# EAGLE schematic ChargingCircuit (EAGLE 7.6.0)
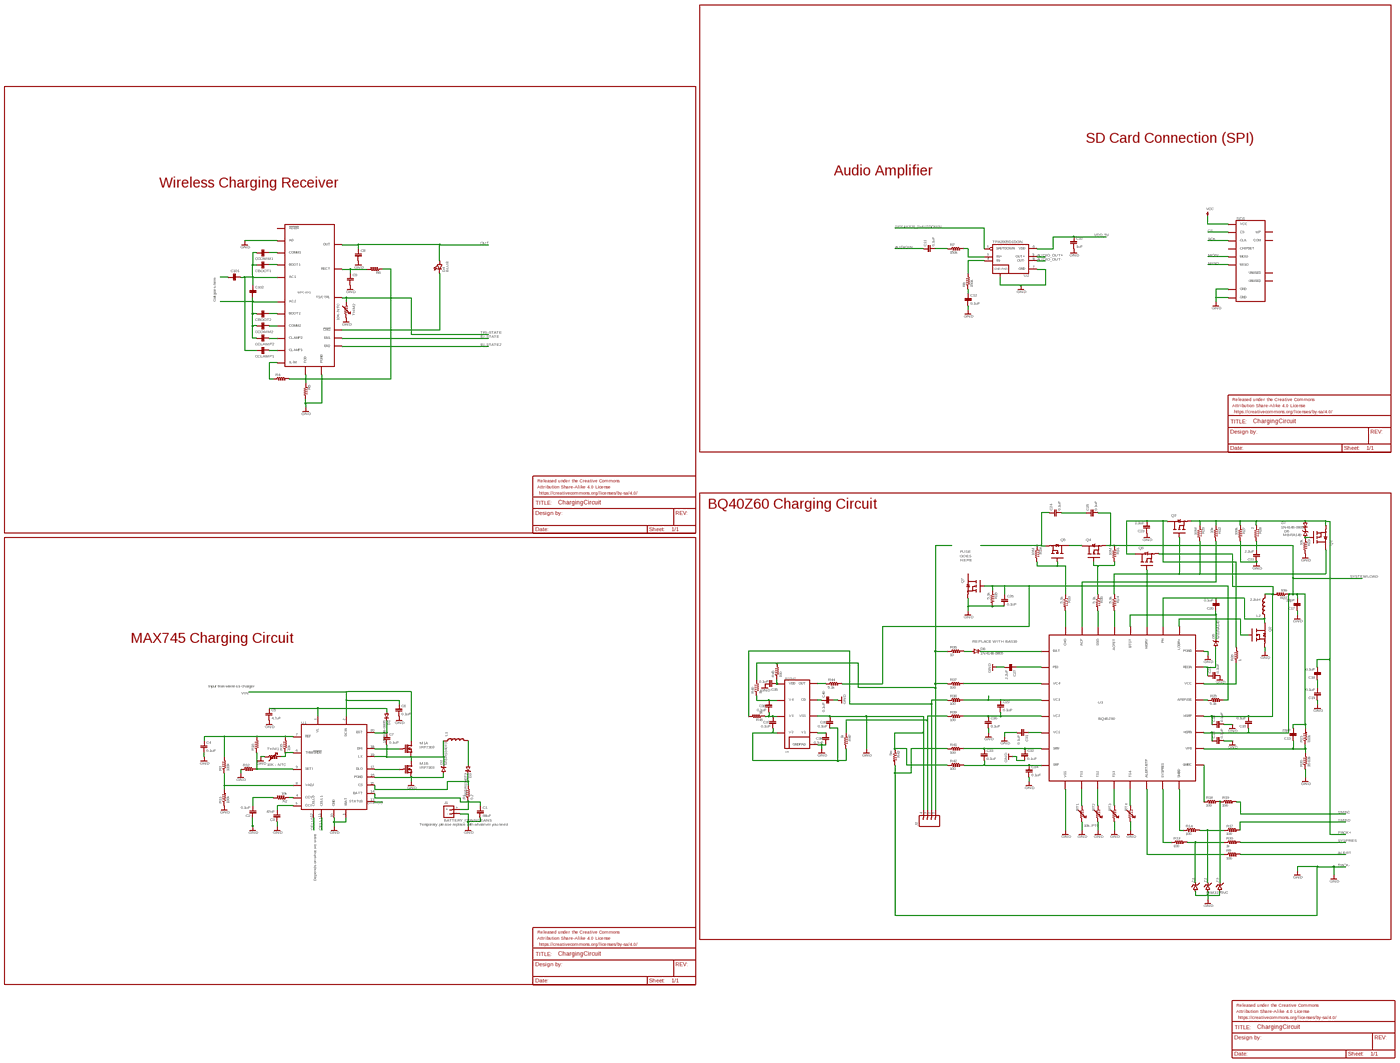
[diagram p0: schematic, sheet 1, overview]
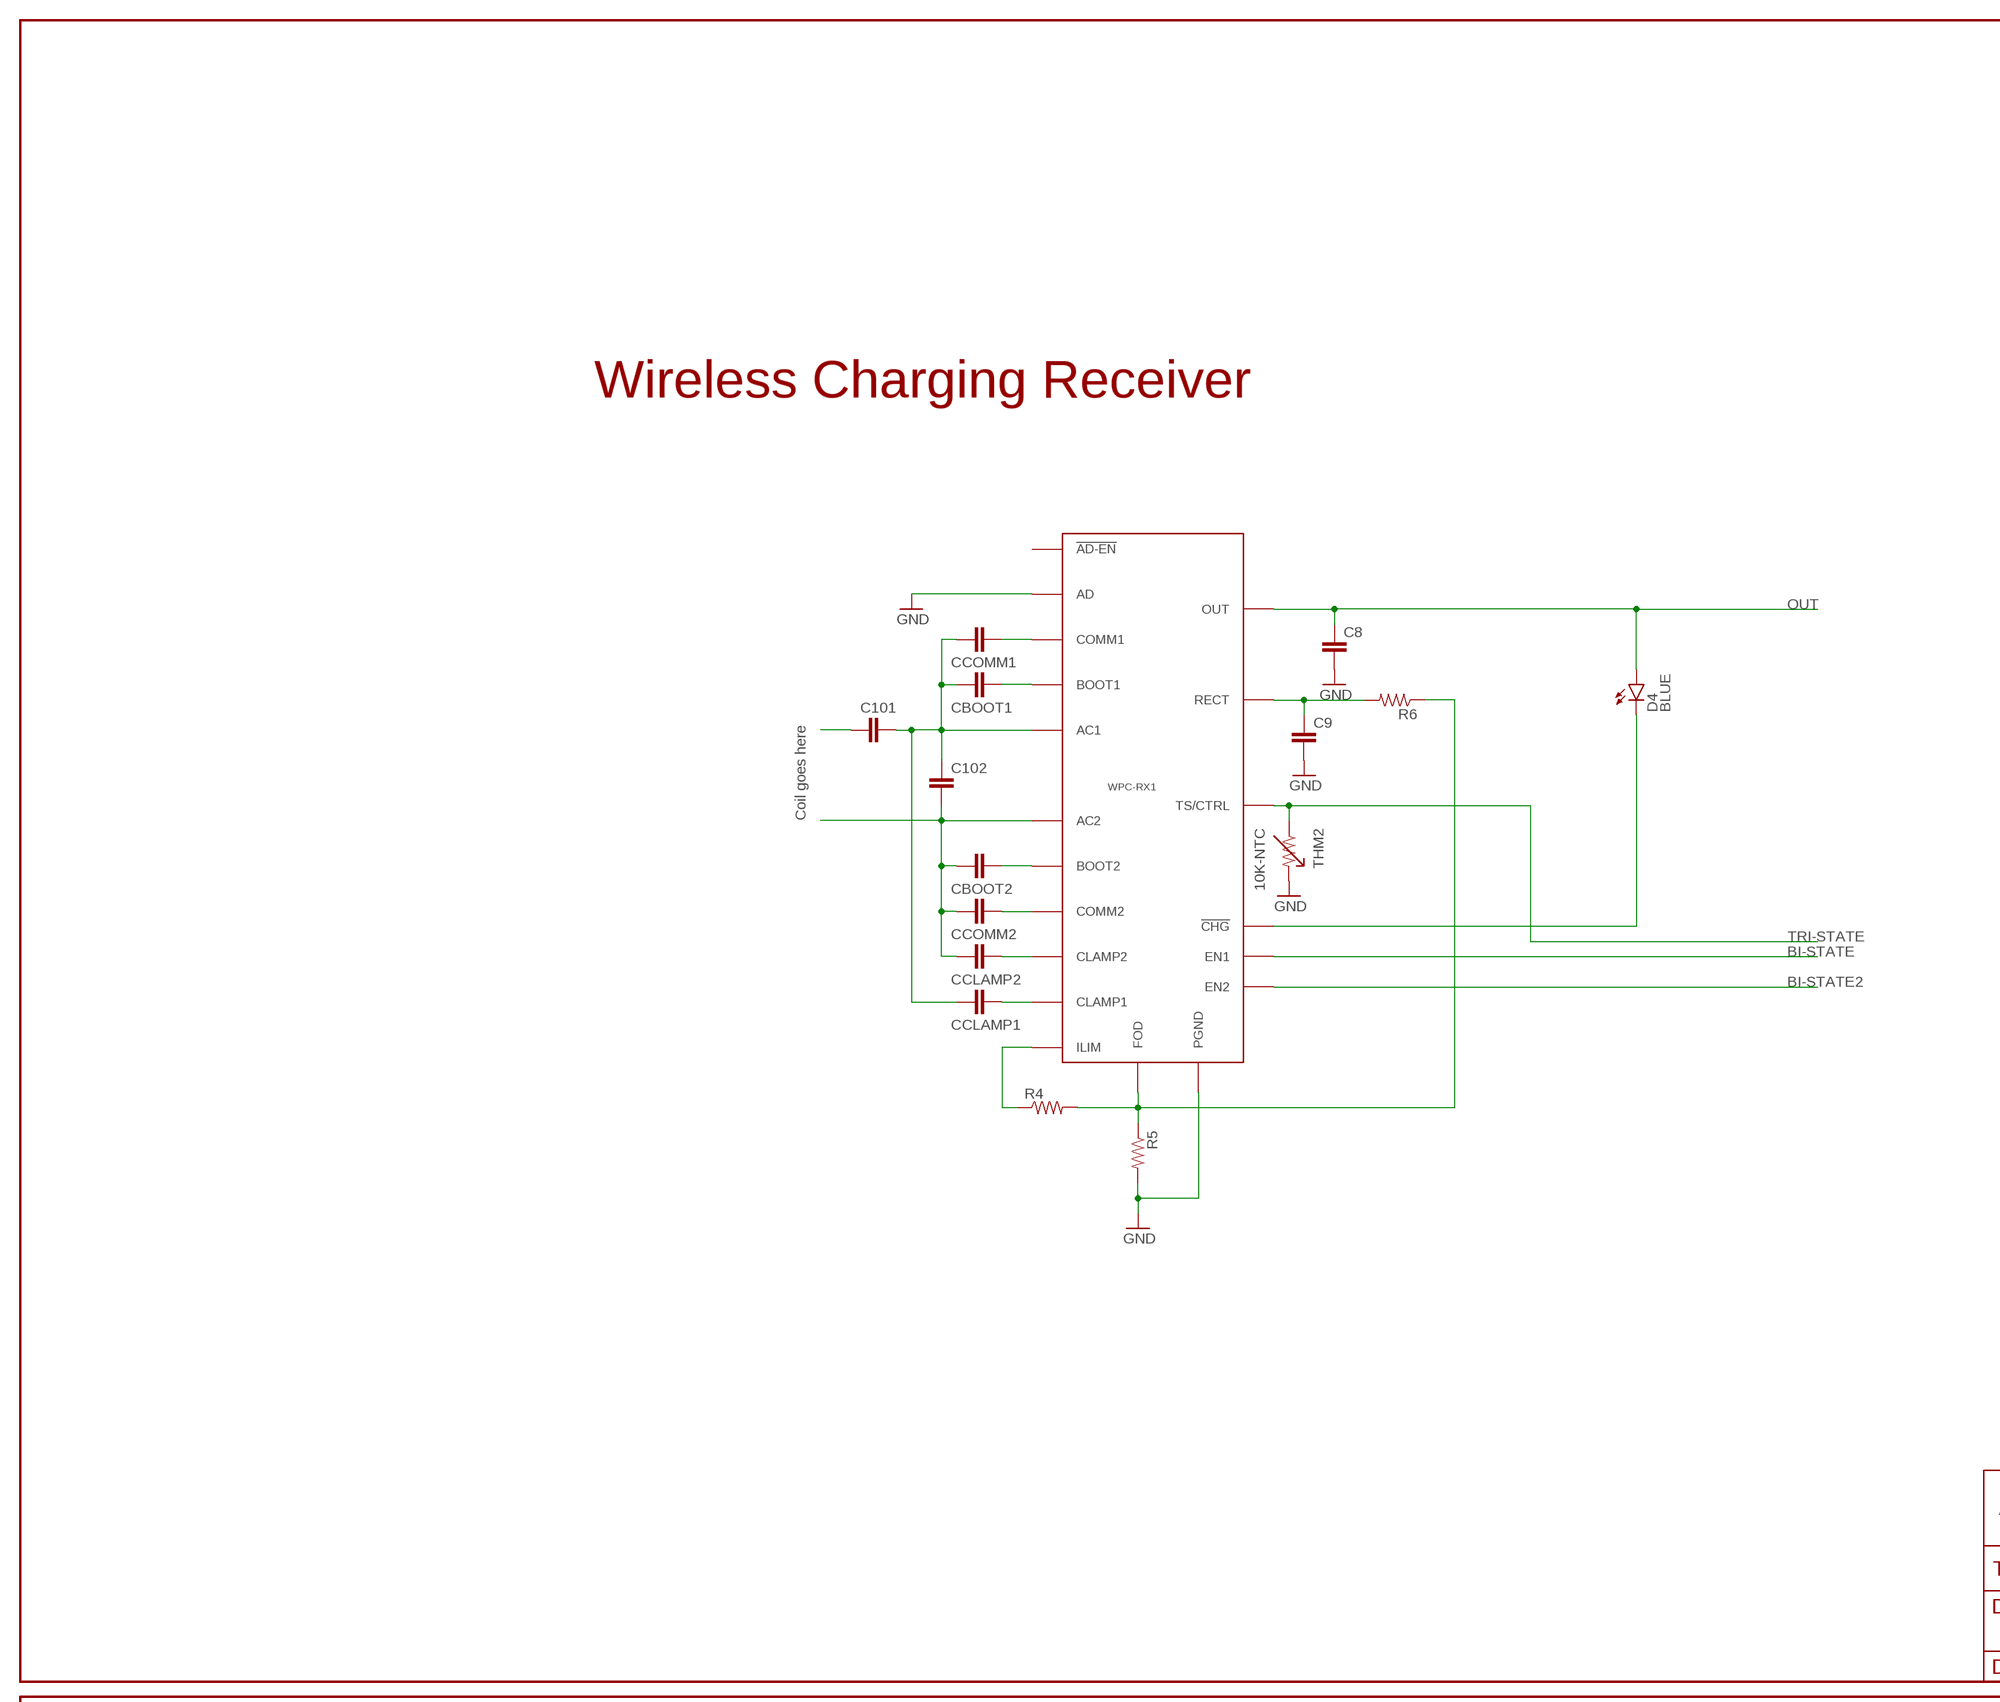
[diagram p1: schematic, sheet 1, part 1 of 4]
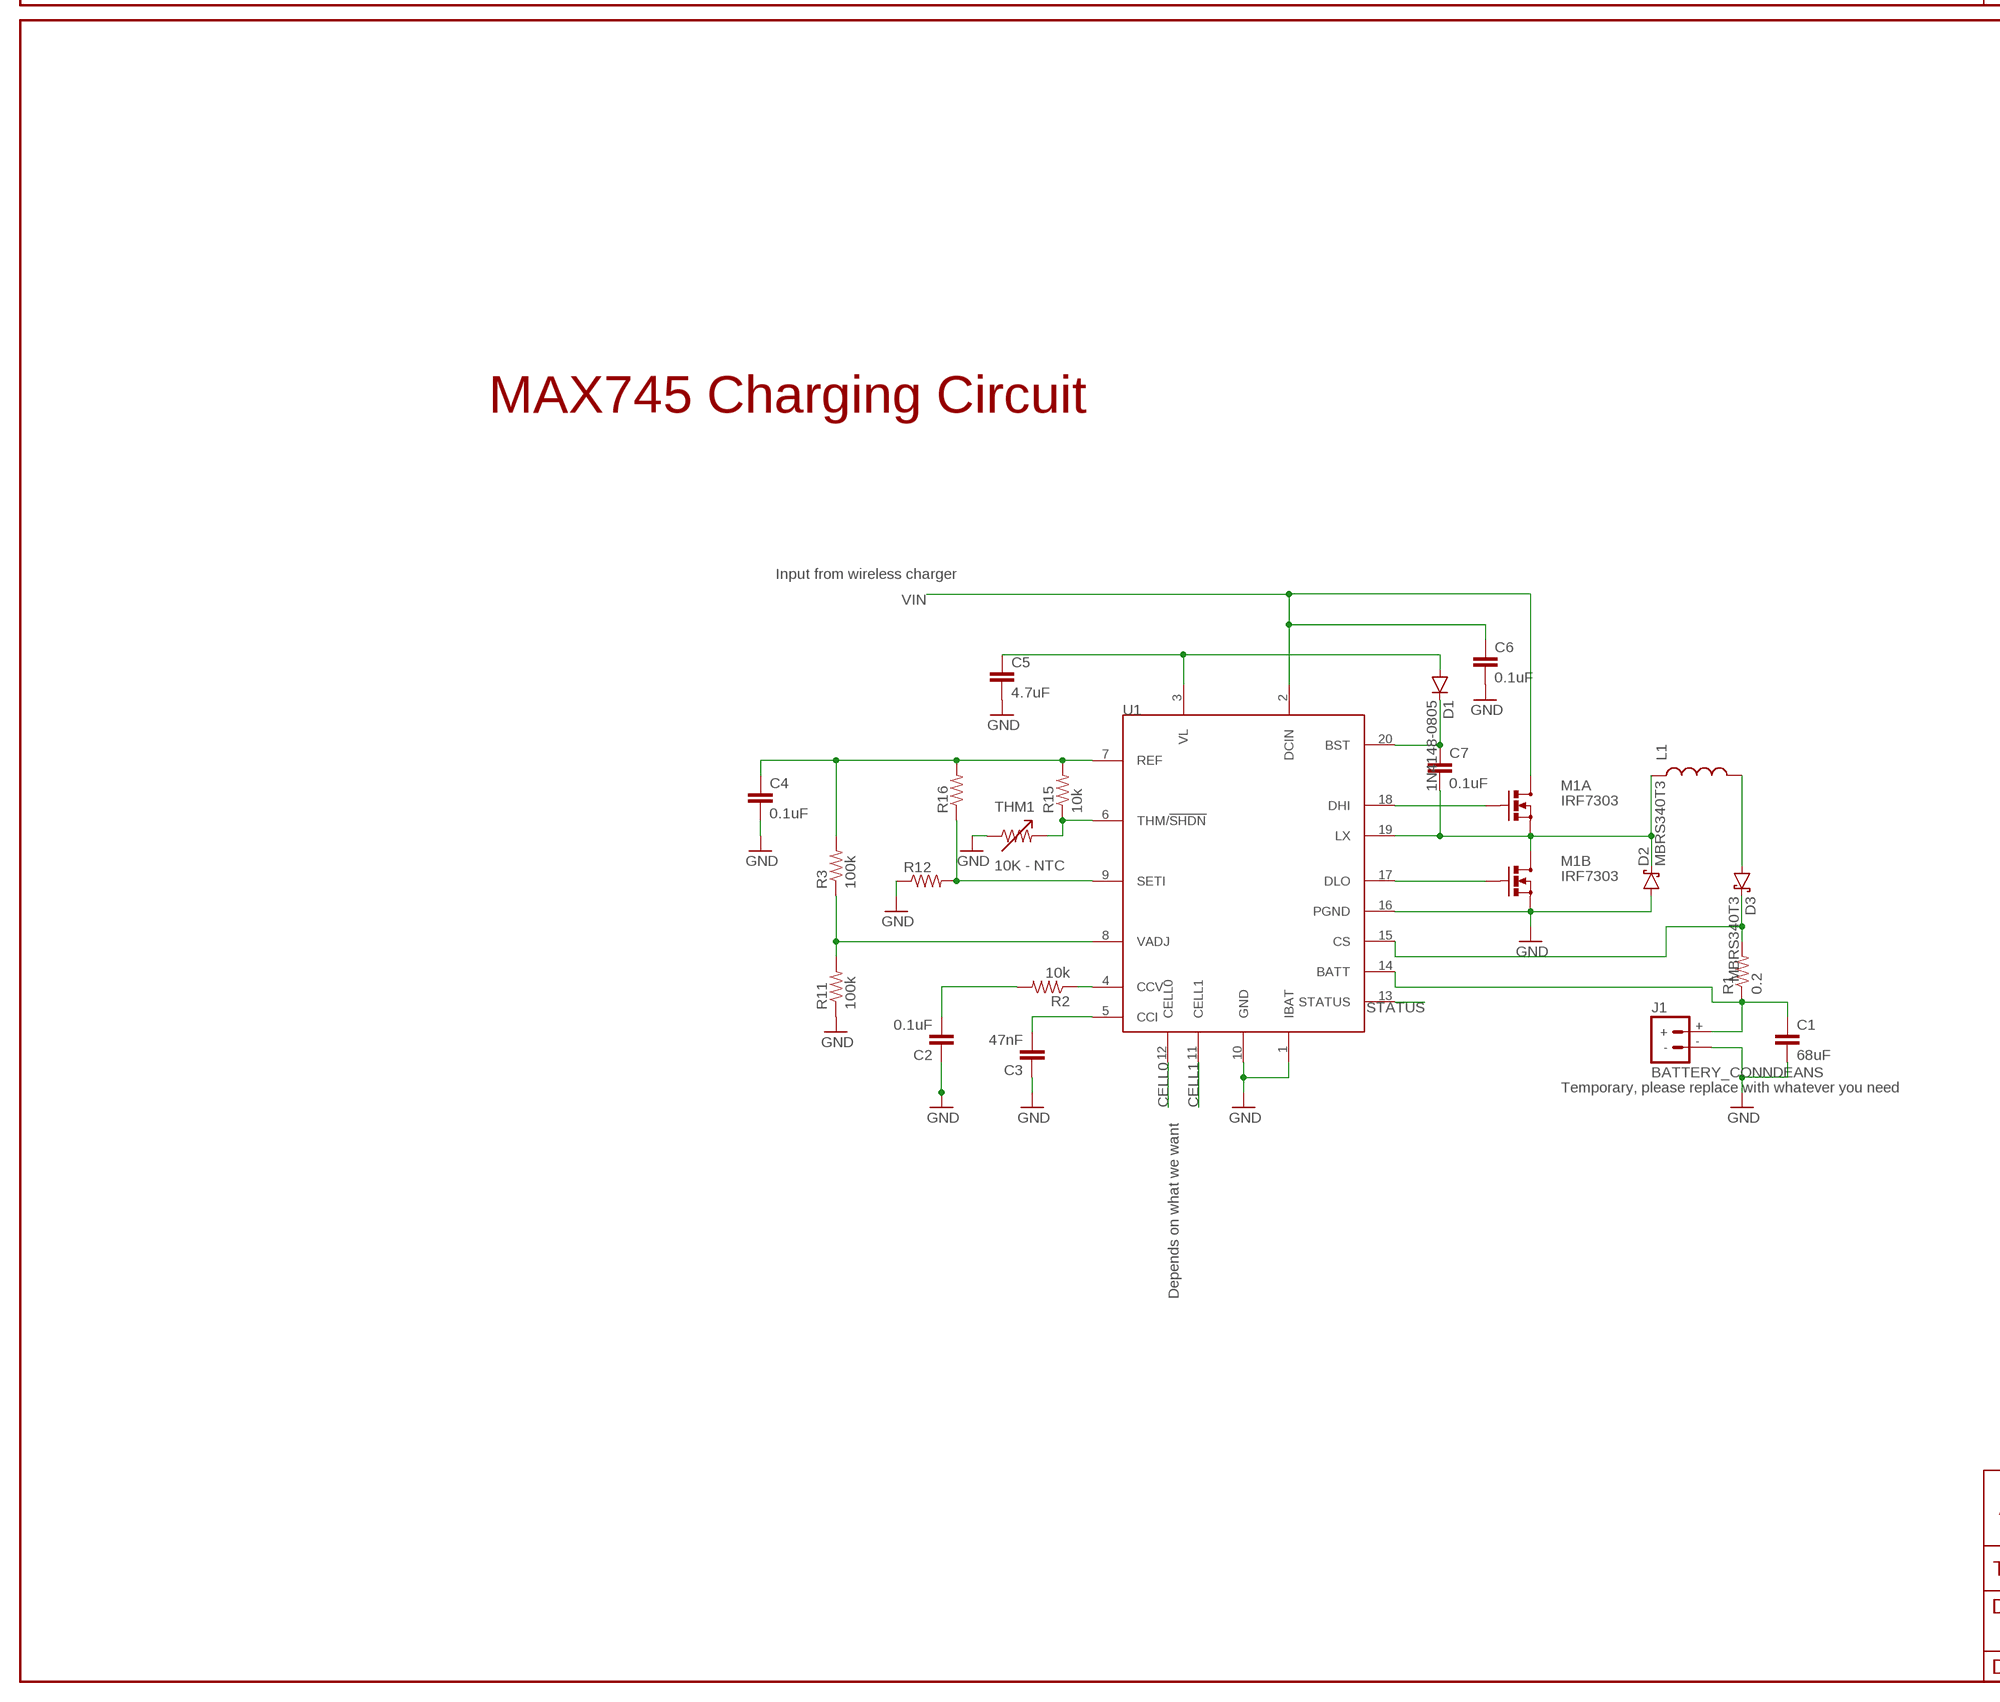
[diagram p2: schematic, sheet 1, part 2 of 4]
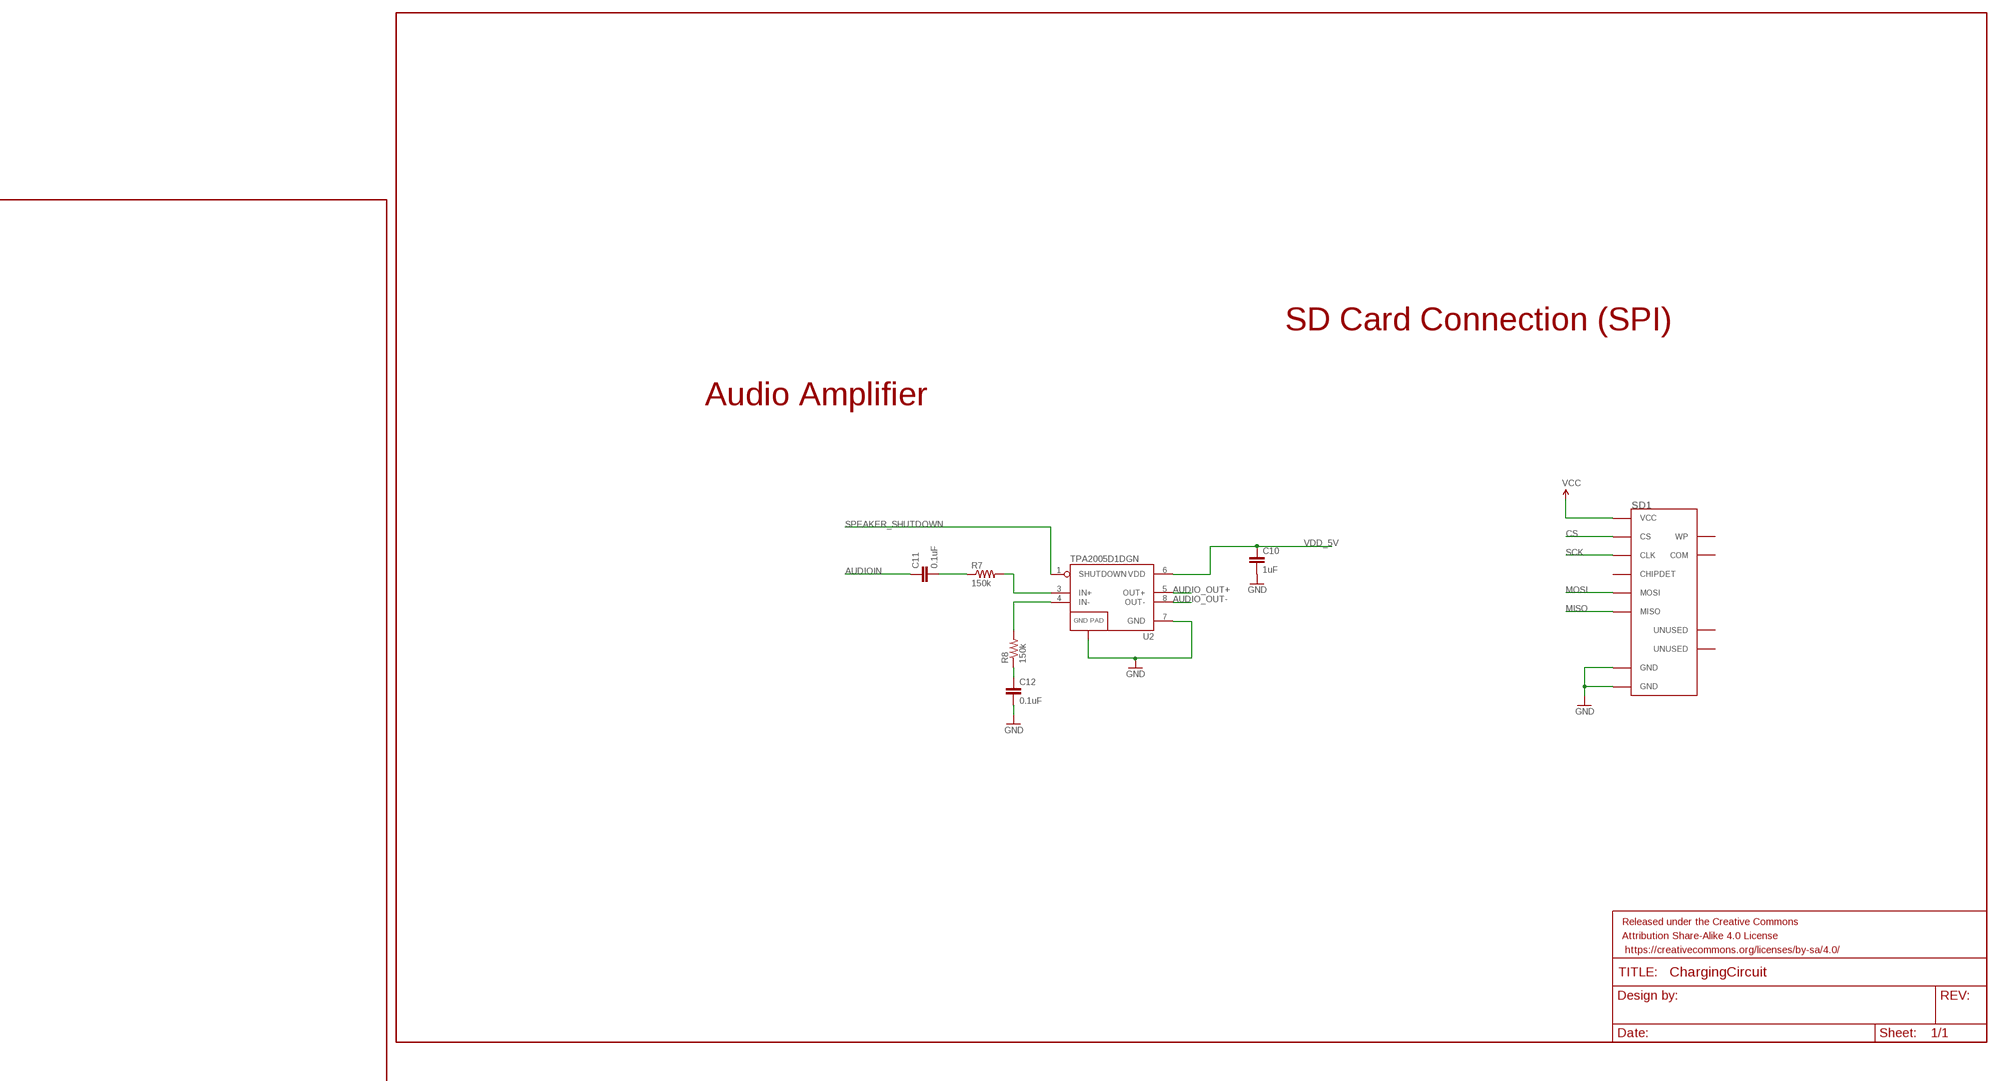
[diagram p3: schematic, sheet 1, part 3 of 4]
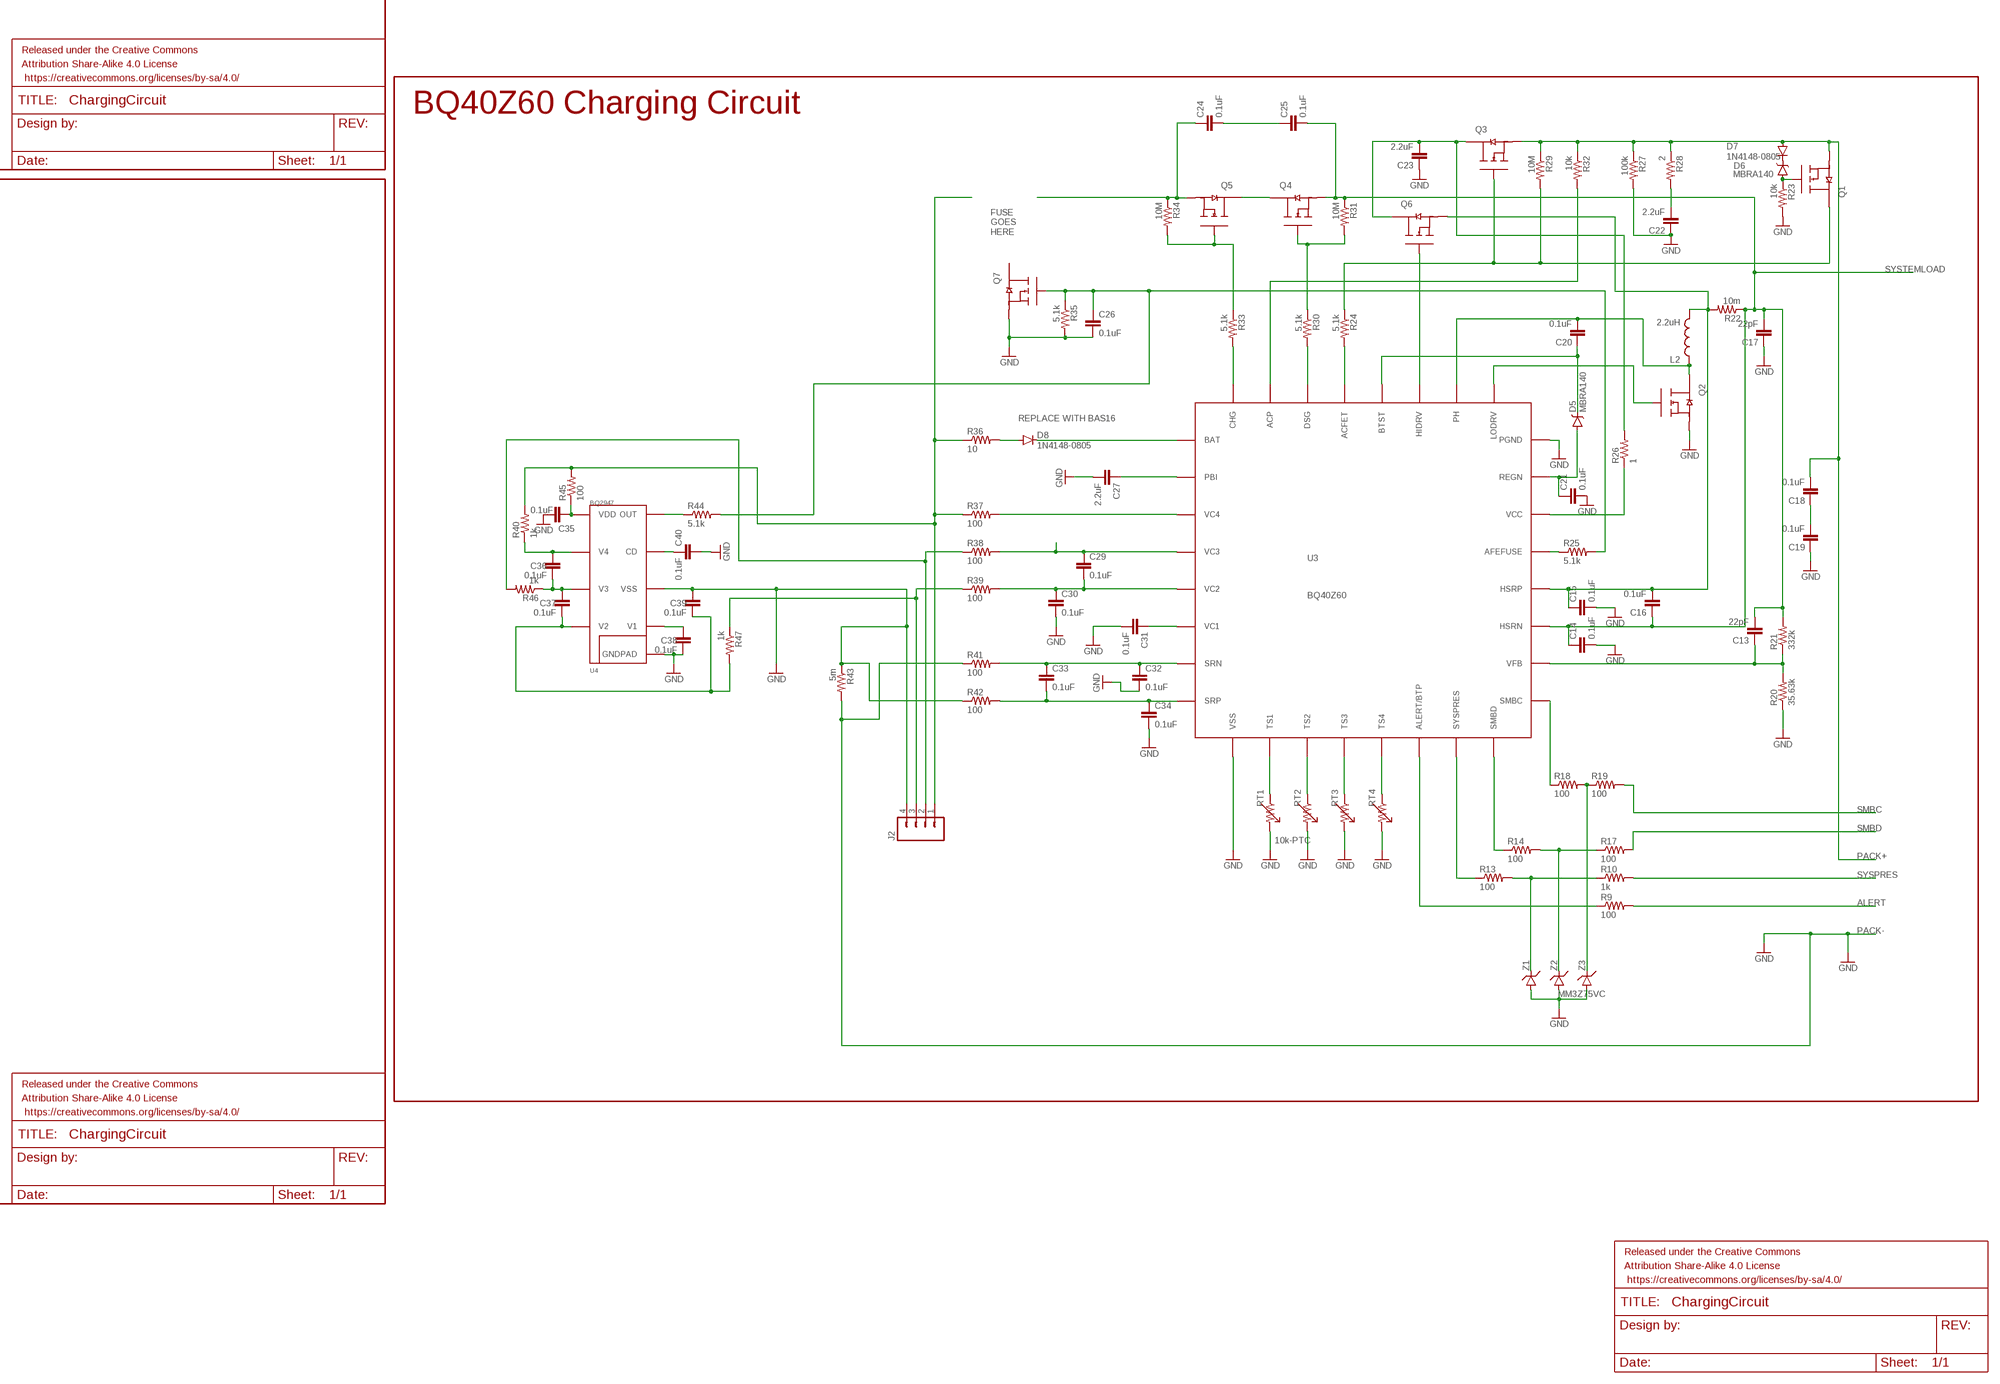
[diagram p4: schematic, sheet 1, part 4 of 4]

## Parts
C1  68uF  CAP0805  [0805]
C2  0.1uF  CAP0805  [0805]
C3  47nF  CAP0805  [0805]
C4  0.1uF  CAP0805  [0805]
C5  4.7uF  CAP0805  [0805]
C6  0.1uF  CAP0805  [0805]
C7  0.1uF  CAP0805  [0805]
C8  CAP0805  [0805]
C9  CAP0805  [0805]
C10  1uF  CAP0805  [0805]
C11  0.1uF  CAP0805  [0805]
C12  0.1uF  CAP0805  [0805]
C13  22pF  CAP0805  [0805]
C14  0.1uF  CAP0805  [0805]
C15  0.1uF  CAP0805  [0805]
C16  0.1uF  CAP0805  [0805]
C17  22pF  CAP0805  [0805]
C18  0.1uF  CAP0805  [0805]
C19  0.1uF  CAP0805  [0805]
C20  0.1uF  CAP0805  [0805]
C21  0.1uF  CAP0805  [0805]
C22  2.2uF  CAP0805  [0805]
C23  2.2uF  CAP0805  [0805]
C24  0.1uF  CAP0805  [0805]
C25  0.1uF  CAP0805  [0805]
C26  0.1uF  CAP0805  [0805]
C27  2.2uF  CAP0805  [0805]
C29  0.1uF  CAP0805  [0805]
C30  0.1uF  CAP0805  [0805]
C31  0.1uF  CAP0805  [0805]
C32  0.1uF  CAP0805  [0805]
C33  0.1uF  CAP0805  [0805]
C34  0.1uF  CAP0805  [0805]
C35  0.1uF  CAP0805  [0805]
C36  0.1uF  CAP0805  [0805]
C37  0.1uF  CAP0805  [0805]
C38  0.1uF  CAP0805  [0805]
C39  0.1uF  CAP0805  [0805]
C40  0.1uF  CAP0805  [0805]
C101  CAP0805  [0805]
C102  CAP0805  [0805]
CBOOT1  CAP0805  [0805]
CBOOT2  CAP0805  [0805]
CCLAMP1  CAP0805  [0805]
CCLAMP2  CAP0805  [0805]
CCOMM1  CAP0805  [0805]
CCOMM2  CAP0805  [0805]
D1  1N4148-0805  [0805-DIODE]
D2  MBRS340T3  [DO-214AB]
D3  MBRS340T3  [DO-214AB]
D4  BLUE  LED-BLUE0603  [LED-0603]
D5  MBRA140  [SMA-DIODE]
D6  MBRA140  DIODE-SCHOTTKY-MBRA140  [SMA-DIODE]
D7  1N4148-0805  [0805-DIODE]
D8  1N4148-0805  [0805-DIODE]
FRAME6  FRAME-LEDGER  [CREATIVE_COMMONS]
FRAME7  FRAME-LEDGER  [CREATIVE_COMMONS]
FRAME8  FRAME-LEDGER  [CREATIVE_COMMONS]
FRAME9  FRAME-LEDGER  [CREATIVE_COMMONS]
J1  BATTERY_CONNDEANS  [DEANS]
J2  M04JST  [1X04-1.5MM_JST]
L1  INDUCTOR0805  [0805]
L2  2.2uH  INDUCTOR0805  [0805]
M1  IRF7303  [SO08]
Q1  CSD17308Q3  [SON-8]
Q2  CSD17308Q3  [SON-8]
Q3  CSD17308Q3  [SON-8]
Q4  CSD17308Q3  [SON-8]
Q5  CSD17308Q3  [SON-8]
Q6  CSD17308Q3  [SON-8]
Q7  CSD17308Q3  [SON-8]
R1  0.2  RESISTOR0805-RES  [0805]
R2  10k  RESISTOR0805-RES  [0805]
R3  100k  RESISTOR0805-RES  [0805]
R4  RESISTOR0805-RES  [0805]
R5  RESISTOR0805-RES  [0805]
R6  RESISTOR0805-RES  [0805]
R7  150k  RESISTOR0805-RES  [0805]
R8  150k  RESISTOR0805-RES  [0805]
R9  100  RESISTOR0805-RES  [0805]
R10  1k  RESISTOR0805-RES  [0805]
R11  100k  RESISTOR0805-RES  [0805]
R12  RESISTOR0805-RES  [0805]
R13  100  RESISTOR0805-RES  [0805]
R14  100  RESISTOR0805-RES  [0805]
R15  10k  RESISTOR0805-RES  [0805]
R16  RESISTOR0805-RES  [0805]
R17  100  RESISTOR0805-RES  [0805]
R18  100  RESISTOR0805-RES  [0805]
R19  100  RESISTOR0805-RES  [0805]
R20  35.63k  RESISTOR0805-RES  [0805]
R21  332k  RESISTOR0805-RES  [0805]
R22  10m  RESISTOR0805-RES  [0805]
R23  10k  RESISTOR0805-RES  [0805]
R24  5.1k  RESISTOR0805-RES  [0805]
R25  5.1k  RESISTOR0805-RES  [0805]
R26  1  RESISTOR0805-RES  [0805]
R27  100k  RESISTOR0805-RES  [0805]
R28  2  RESISTOR0805-RES  [0805]
R29  10M  RESISTOR0805-RES  [0805]
R30  5.1k  RESISTOR0805-RES  [0805]
R31  10M  RESISTOR0805-RES  [0805]
R32  10k  RESISTOR0805-RES  [0805]
R33  5.1k  RESISTOR0805-RES  [0805]
R34  10M  RESISTOR0805-RES  [0805]
R35  5.1k  RESISTOR0805-RES  [0805]
R36  10  RESISTOR0805-RES  [0805]
R37  100  RESISTOR0805-RES  [0805]
R38  100  RESISTOR0805-RES  [0805]
R39  100  RESISTOR0805-RES  [0805]
R40  1k  RESISTOR0805-RES  [0805]
R41  100  RESISTOR0805-RES  [0805]
R42  100  RESISTOR0805-RES  [0805]
R43  5m  RESISTOR0805-RES  [0805]
R44  5.1k  RESISTOR0805-RES  [0805]
R45  100  RESISTOR0805-RES  [0805]
R46  1k  RESISTOR0805-RES  [0805]
R47  1k  RESISTOR0805-RES  [0805]
RT1  10k-PTC  THM  [0805]
RT2  THM  [0805]
RT3  THM  [0805]
RT4  THM  [0805]
SD1  5738-SDCARD  [SD-5738]
THM1  10K - NTC  THM  [0805]
THM2  10K-NTC  THM  [0805]
U1  MAX745EACSSOP  [SSOP20]
U2  TPA2005D1DGN  [POWER-SOP8]
U3  BQ40Z60  [S-PVQFN-N32]
U4  BQ2947  [WSON-8]
WPC-RX1  BQ51013B-20VQFN  [20-VQFN]
Z1  MM3Z75VC  [SOD-323F]
Z2  MM3Z75VC  [SOD-323F]
Z3  MM3Z75VC  [SOD-323F]

## Nets
AC1: C101.2 C102.1 CBOOT1.1 CCLAMP1.1 CCOMM1.1 WPC-RX1.P$2(AC1)
AC2: C102.2 CBOOT2.1 CCLAMP2.1 CCOMM2.1 WPC-RX1.P$19(AC2)
ALERT: R9.2
AUDIO_OUT+: U2.5(OUT+)
AUDIO_OUT-: U2.8(OUT-)
AUDIOIN: C11.1
BI-STATE: WPC-RX1.P$10(EN1)
BI-STATE2: WPC-RX1.P$11(EN2)
BOOT2: CBOOT2.2 WPC-RX1.P$17(BOOT2)
CELL0: U1.12(CELL0)
CELL1: U1.11(CELL1)
CS: SD1.P$1(CS)
GND: C1.2 C2.1 C3.1 C4.2 C5.2 C6.2 C8.2 C9.2 C10.2 C12.2 C14.2 C15.2 C17.1 C19.1 C21.2 C22.1 C23.1 C26.2 C27.2 C30.2 C31.2 C32.2 C34.2 C35.2 C38.2 C39.1 C40.2 D2.POS(A) J1.- J2.4 M1.3(B:S) Q2.P$1(S1) Q2.P$2(S1) Q2.P$3(S1) Q7.P$1(S1) Q7.P$2(S1) Q7.P$3(S1) R5.2 R11.1 R12.1 R20.1 R23.2 R27.2 R35.2 R42.1 R43.1 RT1.2 RT2.2 RT3.2 RT4.2 SD1.P$3(GND) SD1.P$6(GND) THM1.1 THM2.2 U1.1(IBAT) U1.10(GND) U1.16(PGND) U2.7(GND) U2.9(GND) U3.P$9(VSS) U3.P$24(PGND) U3.P$GND(VSS) U4.P$6(VSS) U4.P$GND(GNDPAD) WPC-RX1.P$1(PGND) WPC-RX1.P$9(AD) WPC-RX1.P$20(PGND) Z1.1(A) Z2.1(A) Z3.1(A)
MISO: SD1.P$7(MISO)
MOSI: SD1.P$2(MOSI)
N$1: C5.1 D1.1(A) U1.3(VL)
N$2: C7.1 D1.2(C) U1.20(BST)
N$3: M1.2(A:G) U1.18(DHI)
N$4: M1.4(B:G) U1.17(DLO)
N$5: D3.NEG(C) R1.2 U1.15(CS)
N$6: D3.POS(A) L1.2
N$7: C1.1 J1.+ R1.1 U1.14(BATT)
N$8: C7.2 D2.NEG(C) L1.1 M1.1(A:S) M1.5(B:D) M1.6(B:D) U1.19(LX)
N$9: C3.2 U1.5(CCI)
N$10: R2.1 U1.4(CCV)
N$11: C2.2 R2.2
N$12: C4.1 R3.2 R15.2 R16.2 U1.7(REF)
N$13: R12.2 R16.1 U1.9(SETI)
N$14: R15.1 THM1.2 U1.6(THM/!SHDN)
N$15: R3.1 R11.2 U1.8(VADJ)
N$16: CCOMM2.2 WPC-RX1.P$15(COMM2)
N$17: CCLAMP2.2 WPC-RX1.P$16(CLAMP2)
N$18: CCLAMP1.2 WPC-RX1.P$5(CLAMP1)
N$19: CBOOT1.2 WPC-RX1.P$3(BOOT1)
N$20: CCOMM1.2 WPC-RX1.P$6(COMM1)
N$21: C101.1
N$22: R4.1 WPC-RX1.P$12(ILIM)
N$23: R4.2 R5.1 R6.1 WPC-RX1.P$14(FOD)
N$24: D4.C WPC-RX1.P$7(!CHG)
N$25: C9.1 R6.2 WPC-RX1.P$18(RECT)
N$26: R7.2 U2.3(IN+)
N$27: SD1.P$4(VCC) ; supply symbol labelled VCC
N$28: C11.2 R7.1
N$29: R10.1 R13.2 Z1.2(C)
N$30: R8.2 U2.4(IN-)
N$31: RT1.1 U3.P$10(TS1)
N$32: C12.1 R8.1
N$33: RT2.1 U3.P$11(TS2)
N$34: RT3.1 U3.P$12(TS3)
N$35: RT4.1 U3.P$13(TS4)
N$36: R9.1 U3.P$14(ALERT/BTP)
N$37: Q1.P$5(D1) Q1.P$6(D1) Q1.P$7(D1) Q1.P$8(D1) Q3.P$4(G1) R24.1 R29.2
N$38: R13.1 U3.P$15(SYSPRES)
N$39: R14.1 U3.P$16(SMBD)
N$40: R14.2 R17.1 Z2.2(C)
N$41: C13.1 R20.2 R21.1 U3.P$18(VFB)
N$42: R24.2 U3.P$29(ACFET)
N$43: C18.1 C19.2
N$44: R18.1 U3.P$17(SMBC)
N$45: R18.2 R19.1 Z3.2(C)
N$46: C15.1 C16.2 L2.2 Q6.P$1(S1) Q6.P$2(S1) Q6.P$3(S1) R22.2 U3.P$20(HSRP)
N$47: R26.1 U3.P$22(VCC)
N$48: D6.A Q1.P$4(G1) R23.1
N$50: C20.2 L2.1 Q2.P$5(D1) Q2.P$6(D1) Q2.P$7(D1) Q2.P$8(D1) U3.P$26(PH)
N$51: C20.1 D5.C U3.P$28(BTST)
N$52: C21.1 D5.A U3.P$23(REGN)
N$53: C23.2 Q3.P$5(D1) Q3.P$6(D1) Q3.P$7(D1) Q3.P$8(D1) Q6.P$5(D1) Q6.P$6(D1) Q6.P$7(D1) Q6.P$8(D1) R26.2
N$54: R25.1 U3.P$21(AFEFUSE)
N$55: C26.1 Q7.P$4(G1) R25.2 R35.1 R44.2
N$56: Q6.P$4(G1) U3.P$27(HIDRV)
N$57: D6.C D7.2(C)
N$58: C22.2 R28.2
N$59: Q2.P$4(G1) U3.P$25(LODRV)
N$60: R30.2 U3.P$31(DSG)
N$61: Q4.P$4(G1) R30.1 R31.2
N$62: R32.2 U3.P$30(ACP)
N$63: Q4.P$5(D1) Q4.P$6(D1) Q4.P$7(D1) Q4.P$8(D1) Q5.P$5(D1) Q5.P$6(D1) Q5.P$7(D1) Q5.P$8(D1)
N$64: C24.2 C25.1
N$65: C24.1 Q5.P$1(S1) Q5.P$2(S1) Q5.P$3(S1) R34.1
N$66: Q5.P$4(G1) R33.1 R34.2
N$67: R33.2 U3.P$32(CHG)
N$68: C40.1 U4.P$7(CD)
N$69: J2.1 R36.1 R37.1 R40.2 R45.2
N$70: D8.2(C) U3.P$1(BAT)
N$71: D8.1(A) R36.2
N$72: C27.1 U3.P$2(PBI)
N$73: R37.2 U3.P$3(VC4)
N$74: C29.1 R38.2 U3.P$4(VC3)
N$75: C29.2 C30.1 R39.2 U3.P$5(VC2)
N$76: C31.1 U3.P$6(VC1)
N$77: C32.1 C33.1 R41.2 U3.P$7(SRN)
N$78: C33.2 C34.1 R42.2 U3.P$8(SRP)
N$79: R44.1 U4.P$8(OUT)
N$80: C36.1 R40.1 U4.P$2(V4)
N$81: J2.2 R38.1 R46.2
N$82: J2.3 R39.1 R47.1
N$83: C35.1 R45.1 U4.P$1(VDD)
N$84: C36.2 C37.1 R46.1 U4.P$3(V3)
N$85: C37.2 C39.2 R47.2 U4.P$4(V2)
N$86: C38.1 U4.P$5(V1)
OUT: C8.1 D4.A WPC-RX1.P$4(OUT)
PACK+: C18.2 D7.1(A) Q1.P$1(S1) Q1.P$2(S1) Q1.P$3(S1) Q3.P$1(S1) Q3.P$2(S1) Q3.P$3(S1) R27.1 R28.1 R29.1 R32.1
PACK-: R41.1 R43.2 ; supply symbol labelled GND
SCK: SD1.P$5(CLK)
SMBC: R19.2
SMBD: R17.2
SPEAKER_SHUTDOWN: U2.1(SHUTDOWN)
STATUS: U1.13(STATUS)
SYSPRES: R10.2
SYSTEMLOAD: C13.2 C14.1 C16.1 C17.2 C25.2 Q4.P$1(S1) Q4.P$2(S1) Q4.P$3(S1) R21.2 R22.1 R31.1 U3.P$19(HSRN)
TRI-STATE: THM2.1 WPC-RX1.P$13(TS/CTRL)
VDD_5V: C10.1 U2.6(VDD)
VIN: C6.1 M1.7(A:D) M1.8(A:D) U1.2(DCIN)
Unconnected: Q7.P$5(D1) Q7.P$6(D1) Q7.P$7(D1) Q7.P$8(D1) SD1.P$8(UNUSED) SD1.P$9(UNUSED) SD1.P$CARDDETECT(CHIPDET) SD1.P$COM(COM) SD1.P$WRITEPROTECT(WP) WPC-RX1.P$8(!AD-EN)

## Notes on the sheet
- SD Card Connection (SPI)
- Audio Amplifier
- Wireless Charging Receiver
- Coil goes here
- BQ40Z60 Charging Circuit
- FUSE
  GOES
  HERE
- MAX745 Charging Circuit | REPLACE WITH BAS16
- Input from wireless charger
- Temporary, please replace with whatever you need
- Depends on what we want

## Library data of the parts
C1-C27 C29-C40 C101 C102 CBOOT1 CBOOT2 CCLAMP1 CCLAMP2 CCOMM1 CCOMM2 = SparkFun-Capacitors:CAP: Capacitor Standard 0603 ceramic capacitor, and 0.1" leaded capacitor.
D1 D7 D8 = BB8:1N4148-0805
D2 D3 = BB8:MBRS340T3
D4 = SparkFun-LED:LED-BLUE: Blue LEDs for production use Various blue LEDs stocked by SparkFun production 0603 - DIO-08575 Rebel - DIO-09553 1206 - DIO-09911; PROD_ID: DIO-08575
D5 = SparkFun-DiscreteSemi:MBRA140: 40V, 1A Schottky rectifier SMA/DO-214AC package DIO-08053; PROD_ID: DIO-08053
D6 = SparkFun-DiscreteSemi:DIODE-SCHOTTKY: Schottky diodes in SFE's production catalog BAT20J 1A 23V 0.62Vf RB751 120mA 40V 0.37Vf PMEG4005EJ 0.5A 40V 0.42Vf MBRA140 1A 40V 0.5Vf B340A 3A 40V SMA; PROD_ID: DIO-08053
FRAME6-FRAME9 = SparkFun-Aesthetics:FRAME-LEDGER: Schematic Frame Standard 11x14 US Ledger frame
J1 = SparkFun-Connectors:BATTERY_CONN: Various footprints for battery connectors
J2 = SparkFun-Connectors:M04: Header 4 Standard 4-pin 0.1" header. Use with straight break away headers (SKU : PRT-00116), right angle break away headers (PRT-00553), swiss pins (PRT-00743), machine pins (PRT-00117), and female headers (PRT-00115). Molex polarized connector foot print use with SKU : PRT-08231 with associated crimp pins and housings. 1MM SMD Version SKU: PRT-10208; PROD_ID: CONN-12477
L1 L2 = SparkFun-Passives:INDUCTOR: Inductors Basic Inductor/Choke - 0603 and 1206. Footprints are not proven and vary greatly between part numbers. INDUCTOR POWER 3.3UH 4.0A SMD 0.197" L x 0.197" W x 0.177" H (5.00mm x 5.00mm x 4.50mm)
M1 = BB8:IRF7303
Q1-Q7 = BB8:CSD17308Q3
R1-R8 R11 R12 R15 R16 = SparkFun-Passives:RESISTOR: Resistor Basic schematic elements and footprints for 0603, 1206, and PTH resistors.
R9 R10 R13 R14 R17-R47 = SparkFun-Resistors:RESISTOR: Resistor Basic schematic elements and footprints for 0603, 1206, and PTH resistors.
RT1-RT4 THM1 THM2 = BB8:THM
SD1 = BB8:5738-SDCARD
U1 = BB8:MAX745EAC
U2 = SparkFun-AnalogIC:TPA2005D1: 1.4W MONO CLASS-D AUDIO POWER AMPLIFIER The TPA2005D1 is a 1.4-W high efficiency filter-free class-D audio power amplifier in a BGA, QFN, or MSOP package that requires only three external components. Datasheet: http://focus.ti.com/lit/ds/symlink/tpa2005d1.pdf 1.4 W Into 8 ? From a 5V Supply at THD = 10% (Typ) Maximum Battery Life and Minimum Heat Efficiency With an 8-? Speaker: 84% at 400 mW, 79% at 100 mW 2.8-mA Quiescent Current 0.5-mA Shutdown Current Ideal for Wireless or Cellular Handsets and PDAs Capable of Driving an 8-? Speaker (2.5 V ? VDD ? 5.5 V) and a 4-? Speaker (2.5 V ? VDD ? 4.2 V) Only Three External Components Optimized PWM Output Stage Eliminates LC Output Filter Internally Generated 250-kHz Switching Frequency Eliminates Capacitor and Resistor Improved PSRR (-71 dB at 217 Hz) and Wide Supply Voltage (2.5 V to 5.5 V) Eliminates Need for a Voltage Regulator Fully Differential Design Reduces RF Rectification and Eliminates Bypass Capacitor Improved CMRR Eliminates Two Input Coupling Capacitors
U3 = BB8:BQ40Z60
U4 = BB8:BQ2947
WPC-RX1 = BB8:BQ51013B-20VQFN
Z1-Z3 = BB8:MM3Z75VC